# EAGLE schematic Eagle_Teensy3_6_TAF_BoardV2.1 (EAGLE 8.3.2)
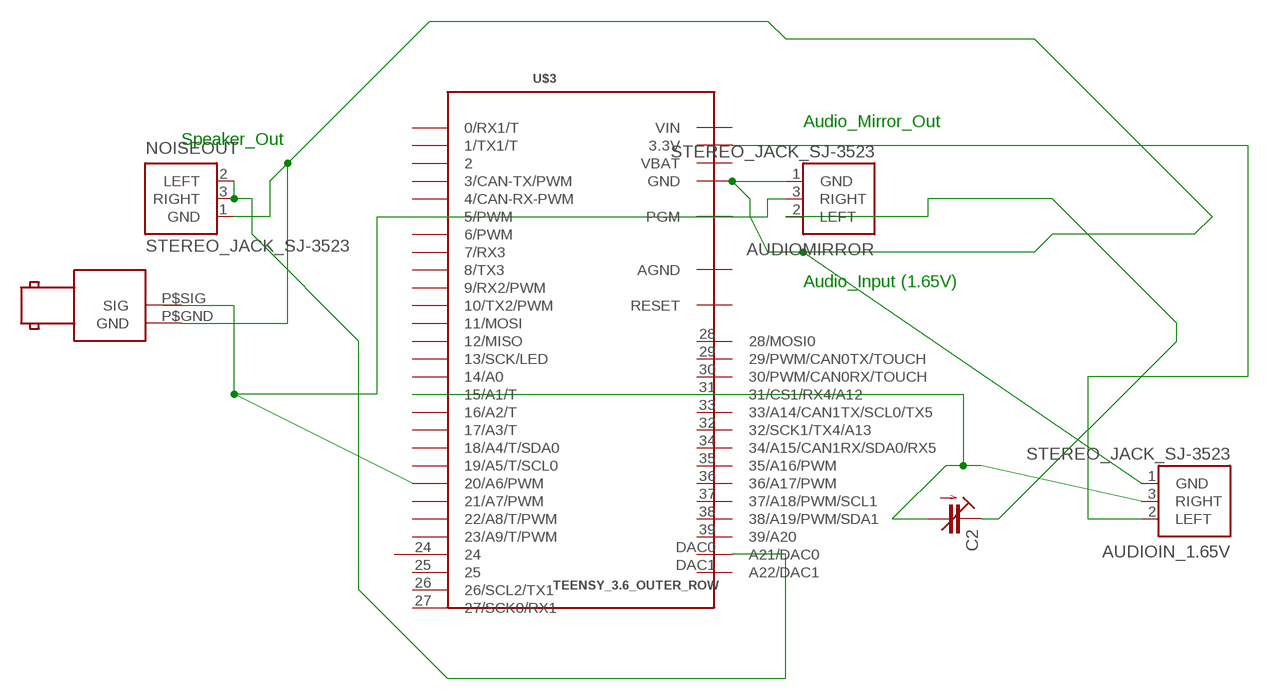
[diagram p0: schematic, sheet 1]

## Parts
AUDIOIN_1.65V  STEREO_JACK_SJ-3523  [SJ-3523]
AUDIOMIRROR  STEREO_JACK_SJ-3523  [SJ-3523]
C2  C-TRIMM3008  [3008]
NOISEOUT  STEREO_JACK_SJ-3523  [SJ-3523]
TTL  BNC_RIGHT_ANGLE  [BNC_RIGHT_ANGLE]
U$3  TEENSY_3.6_OUTER_ROW  [TEENSY3_6-OUTER_ROW]

## Nets
N$1: NOISEOUT.2(LEFT) NOISEOUT.3(RIGHT)
N$2: AUDIOIN_1.65V.1(GND) AUDIOMIRROR.1(GND) NOISEOUT.1(GND) TTL.P$GND(GND) U$3.3.3V2(GND) U$3.GND U$3.GND1(GND) U$3.GND2(GND)
N$3: AUDIOIN_1.65V.2(LEFT) U$3.3.3V U$3.3.3V1(3.3V)
N$5: AUDIOIN_1.65V.3(RIGHT) C2.-(A) U$3.15/A1(15/A1/T)
N$7: AUDIOMIRROR.3(RIGHT)
N$8: AUDIOMIRROR.2(LEFT) C2.+(E)
Unconnected: TTL.P$SIG(SIG) U$3.0(0/RX1/T) U$3.1(1/TX1/T) U$3.2 U$3.3(3/CAN-TX/PWM) U$3.4(4/CAN-RX-PWM) U$3.5(5/PWM) U$3.6(6/PWM) U$3.7(7/RX3) U$3.8(8/TX3) U$3.9(9/RX2/PWM) U$3.10(10/TX2/PWM) U$3.11(11/MOSI) U$3.12(12/MISO) U$3.13(13/SCK/LED) U$3.14/A0 U$3.16/A2(16/A2/T) U$3.17/A3(17/A3/T) U$3.18/A4(18/A4/T/SDA0) U$3.19/A5(19/A5/T/SCL0) U$3.20/A6(20/A6/PWM) U$3.21/A7(21/A7/PWM) U$3.22/A8(22/A8/T/PWM) U$3.23/A9(23/A9/T/PWM) U$3.24 U$3.25 U$3.26(26/SCL2/TX1) U$3.27(27/SCK0/RX1) U$3.28(28/MOSI0) U$3.29(29/PWM/CAN0TX/TOUCH) U$3.30(30/PWM/CAN0RX/TOUCH) U$3.31(31/CS1/RX4/A12) U$3.32(32/SCK1/TX4/A13) U$3.33(33/A14/CAN1TX/SCL0/TX5) U$3.34(34/A15/CAN1RX/SDA0/RX5) U$3.35(35/A16/PWM) U$3.36(36/A17/PWM) U$3.37(37/A18/PWM/SCL1) U$3.38(38/A19/PWM/SDA1) U$3.39(39/A20) U$3.DAC0(A21/DAC0) U$3.DAC1(A22/DAC1) U$3.PGM U$3.RESET

## Notes on the sheet
- Audio_Mirror_Out
- Speaker_Out
- Audio_Input (1.65V)

## Power pins joined to a net without a drawn wire
AGND: U$3.AGND
VBAT: U$3.VBAT
VIN: U$3.VIN

## Library data of the parts
AUDIOIN_1.65V AUDIOMIRROR NOISEOUT = RHD2000_eval_board:STEREO_JACK: CUI Inc. SJ-3523 stereo audio jack
C2 = c-trimm:C-TRIMM: Trimm capacitor; OC_FARNELL: unknown; OC_NEWARK: unknown
TTL = connectors:BNC_RIGHT_ANGLE: BNC plug, through-hole, right-angle
U$3 = Teensy3_6:TEENSY_3.6_OUTER_ROW: Footprint for Teensy 3.1 or 3.2 board using all pin connections on the outer perimeter